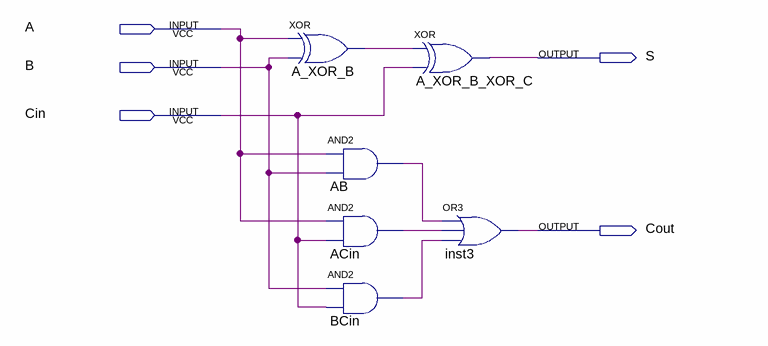
[diagram p0: schematic sheet]
// Quartus schematic Question1.bdf as structural Verilog: 6 symbols, 5 pins
module Question1 (
  input  A,
  input  B,
  input  Cin,
  output S,
  output Cout
);

  wire A_XOR_B_out, AB_out, ACin_out, BCin_out;

  xor A_XOR_B (A_XOR_B_out, A, B);
  and AB (AB_out, A, B);
  and ACin (ACin_out, A, Cin);
  and BCin (BCin_out, B, Cin);
  xor A_XOR_B_XOR_C (S, A_XOR_B_out, Cin);
  or inst3 (Cout, AB_out, ACin_out, BCin_out);
endmodule
